# EAGLE design powernode (EAGLE 6.5.0)
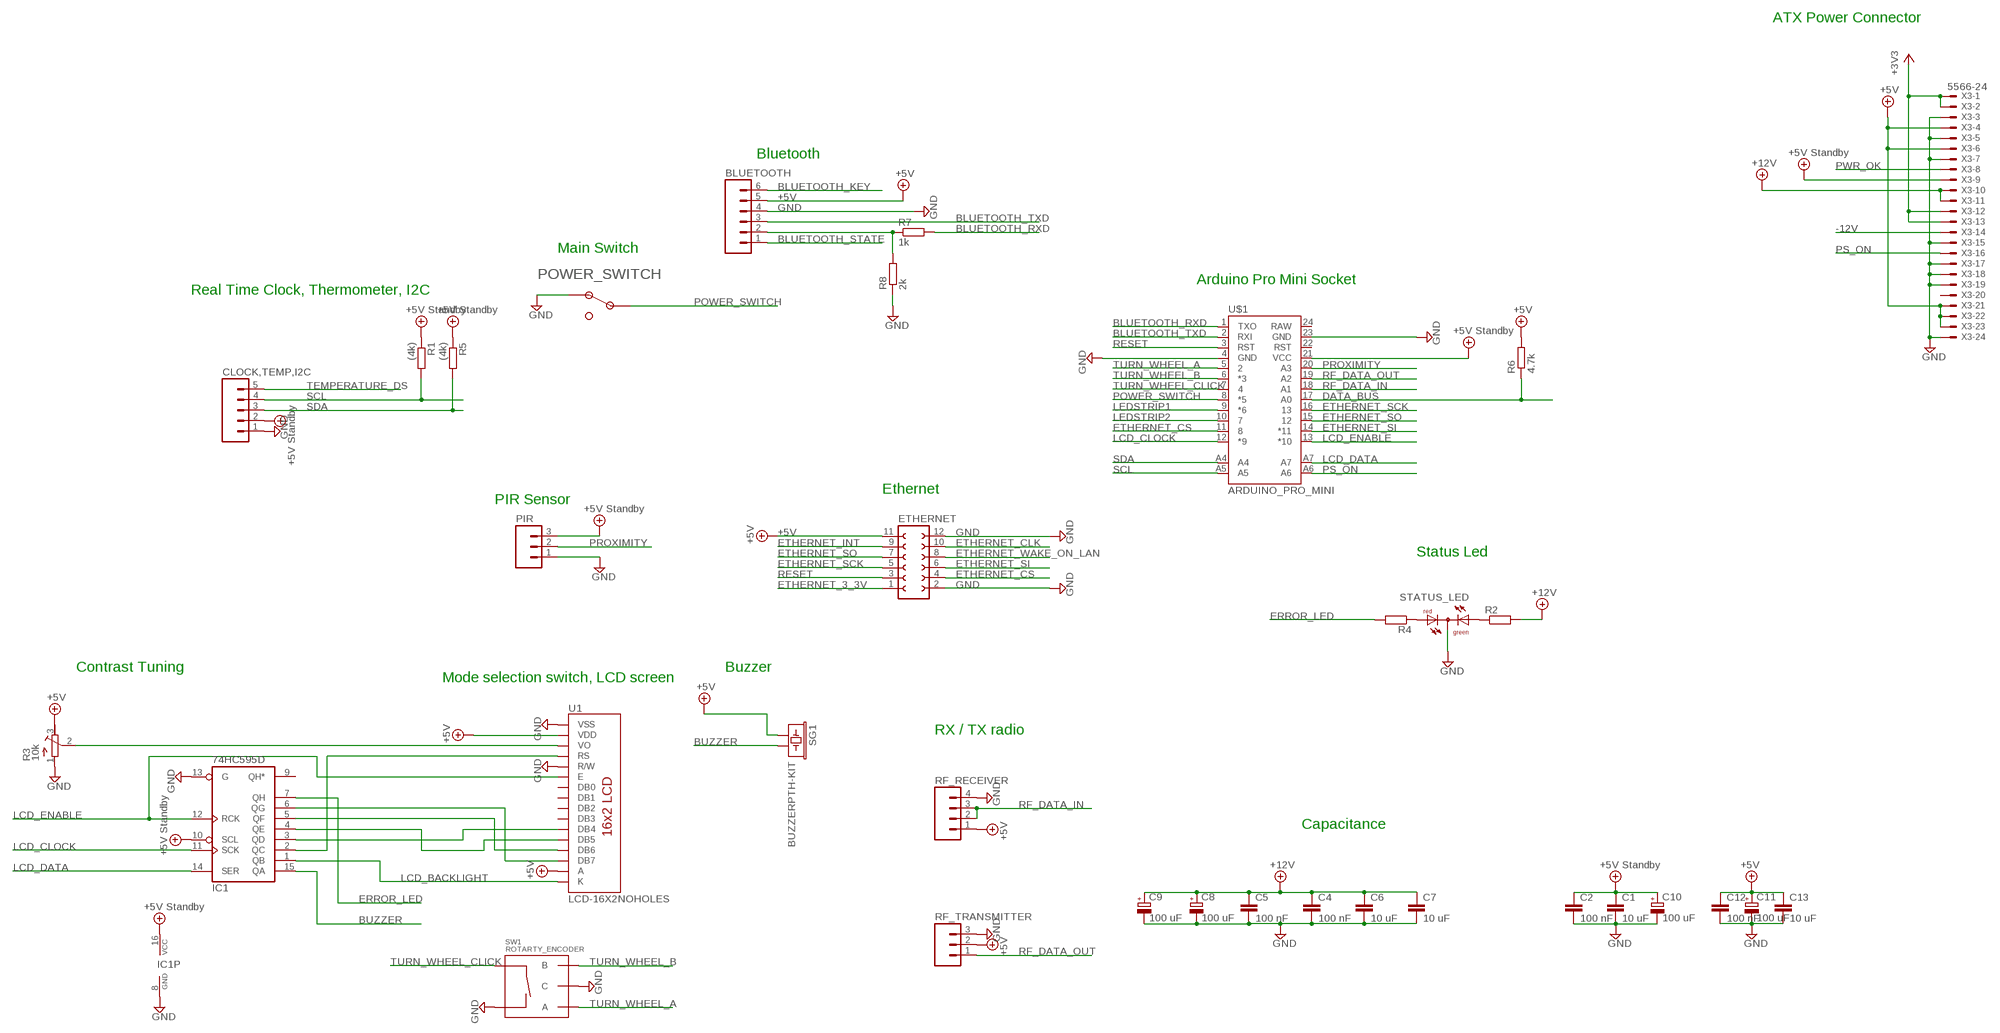
[diagram p0: schematic, sheet 1, part 1 of 2]
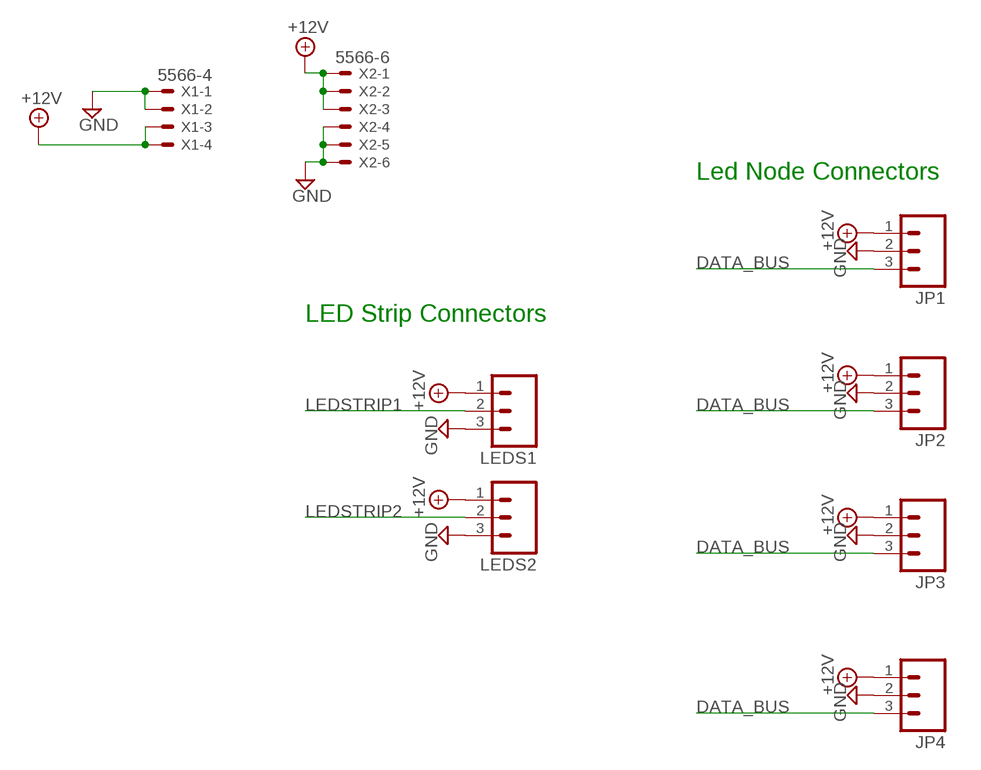
[diagram p1: schematic, sheet 1, part 2 of 2]

## Parts
BLUETOOTH  M06NO_SILK  [1X06_NO_SILK]
C1  10 uF  C-EUC1206  [C1206]
C2  100 nF  C-EUC0805  [C0805]
C4  100 nF  C-EUC0805  [C0805]
C5  100 nF  C-EUC0805  [C0805]
C6  10 uF  C-EUC1206  [C1206]
C7  10 uF  C-EUC1206  [C1206]
C8  100 uF  CPOL-EUE2.5-6  [E2,5-6]
C9  100 uF  CPOL-EUE2.5-6  [E2,5-6]
C10  100 uF  CPOL-EUE2.5-6  [E2,5-6]
C11  100 uF  CPOL-EUE2.5-6  [E2,5-6]
C12  100 nF  C-EUC0805  [C0805]
C13  10 uF  C-EUC1206  [C1206]
CLOCK,TEMP,I2C  M05PTH  [1X05]
ETHERNET  FE06-2  [FE06-2]
IC1  74HC595D  [SO16]
JP1  M03-SCREW-5MM  [SCREWTERMINAL-5MM-3]
JP2  M03-SCREW-5MM  [SCREWTERMINAL-5MM-3]
JP3  M03-SCREW-5MM  [SCREWTERMINAL-5MM-3]
JP4  M03-SCREW-5MM  [SCREWTERMINAL-5MM-3]
LEDS1  M03LONGPADS  [1X03_LONGPADS]
LEDS2  M03LONGPADS  [1X03_LONGPADS]
PIR  M031X03_NO_SILK  [1X03_NO_SILK]
POWER_SWITCH  KNC1-101-2P  [KNC1-101-2P]
R1  (4k)  R-EU_R0805  [R0805]
R2  R-EU_R0805  [R0805]
R3  10k  R-TRIMM3296W  [RTRIM3296W]
R4  R-EU_R0805  [R0805]
R5  (4k)  R-EU_R0805  [R0805]
R6  4.7k  R-EU_R0805  [R0805]
R7  1k  R-EU_R0805  [R0805]
R8  2k  R-EU_R0805  [R0805]
RF_RECEIVER  M041X04_NO_SILK  [1X04_NO_SILK]
RF_TRANSMITTER  M031X03_NO_SILK  [1X03_NO_SILK]
SG1  BUZZERPTH-KIT  [BUZZER-12MM-KIT]
STATUS_LED  DUOLED-RG-C  [DUOLED-C-5MM]
SW1  ROTARTY_ENCODER  [ROTARY_ENC_PLAIN]
U1  LCD-16X2NOHOLES  [LCD-16X2_NOHOLES]
U$1  ARDUINO_PRO_MINI  [ARDUINO_PRO_MINI]
X1  5566-4  [5566-4]
X2  5566-6  [5566-6]
X3  5566-24  [5566-24]

## Nets
+3V3: X3.1 X3.2 X3.12 X3.13
+5V: BLUETOOTH.5 C11.+ C12.1 C13.1 ETHERNET.11 R3.3(A) R6.2 RF_RECEIVER.1 RF_TRANSMITTER.2 SG1.+ U1.2(VDD) U1.15(A) X3.4 X3.6 X3.21 X3.22 X3.23
+5V/2: C1.1 C2.1 C10.+ CLOCK,TEMP,I2C.2 IC1.10(SCL) IC1.16(VCC) PIR.3 R1.1 R5.1 U$1.21(VCC) X3.9 ; supply symbol labelled +5V Standby
+12V: C4.1 C5.1 C6.1 C7.1 C8.+ C9.+ JP1.1 JP2.1 JP3.1 JP4.1 LEDS1.1 LEDS2.1 R2.2 X1.3 X1.4 X2.1 X2.2 X2.3 X3.10 X3.11
-12V: X3.14
BLUETOOTH_KEY: BLUETOOTH.6
BLUETOOTH_RXD: R7.2 U$1.1(TXO)
BLUETOOTH_STATE: BLUETOOTH.1
BLUETOOTH_TXD: BLUETOOTH.3 U$1.2(RXI)
BUZZER: IC1.15(QA) SG1.-
DATA_BUS: JP1.3 JP2.3 JP3.3 JP4.3 R6.1 U$1.17(A0)
ERROR_LED: IC1.7(QH) R4.2
ETHERNET_3_3V: ETHERNET.1
ETHERNET_CLK: ETHERNET.10
ETHERNET_CS: ETHERNET.4 U$1.11
ETHERNET_INT: ETHERNET.9
ETHERNET_SCK: ETHERNET.5 U$1.16
ETHERNET_SI: ETHERNET.6 U$1.14(*11)
ETHERNET_SO: ETHERNET.7 U$1.15
ETHERNET_WAKE_ON_LAN: ETHERNET.8
GND: BLUETOOTH.4 C1.2 C2.2 C4.2 C5.2 C6.2 C7.2 C8.- C9.- C10.- C11.- C12.2 C13.2 CLOCK,TEMP,I2C.1 ETHERNET.2 ETHERNET.12 IC1.8(GND) IC1.13(G) JP1.2 JP2.2 JP3.2 JP4.2 LEDS1.3 LEDS2.3 PIR.1 POWER_SWITCH.P$1 R3.1(E) R8.1 RF_RECEIVER.4 RF_TRANSMITTER.3 STATUS_LED.C SW1.C SW1.SW- U1.1(VSS) U1.5(R/W) U$1.4(GND) U$1.23(GND) X1.1 X1.2 X2.4 X2.5 X2.6 X3.3 X3.5 X3.7 X3.15 X3.17 X3.18 X3.19 X3.24
LCD_BACKLIGHT: IC1.1(QB) U1.16(K)
LCD_CLOCK: IC1.11(SCK) U$1.12(*9)
LCD_DATA: IC1.14(SER) U$1.A7
LCD_ENABLE: IC1.12(RCK) U1.6(E) U$1.13(*10)
LEDSTRIP1: LEDS1.2 U$1.9(*6)
LEDSTRIP2: LEDS2.2 U$1.10
N$1: IC1.3(QD) U1.11(DB4)
N$2: IC1.2(QC) U1.4(RS)
N$5: R2.1 STATUS_LED.AX(AG)
N$7: IC1.4(QE) U1.12(DB5)
N$8: IC1.5(QF) U1.13(DB6)
N$9: IC1.6(QG) U1.14(DB7)
N$10: U1.3(VO)
N$11: R4.1 STATUS_LED.AR
N$21: BLUETOOTH.2 R7.1 R8.2
POWER_SWITCH: POWER_SWITCH.P$2 U$1.8(*5)
PROXIMITY: PIR.2 U$1.20(A3)
PS_ON: U$1.A6 X3.16
PWR_OK: X3.8
RESET: ETHERNET.3 U$1.3(RST)
RF_DATA_IN: RF_RECEIVER.2 RF_RECEIVER.3 U$1.18(A1)
RF_DATA_OUT: RF_TRANSMITTER.1 U$1.19(A2)
SCL: CLOCK,TEMP,I2C.4 R1.2 U$1.A5
SDA: CLOCK,TEMP,I2C.3 R5.2 U$1.A4
TEMPERATURE_DS: CLOCK,TEMP,I2C.5
TURN_WHEEL_A: SW1.A U$1.5
TURN_WHEEL_B: SW1.B U$1.6(*3)
TURN_WHEEL_CLICK: SW1.SW+ U$1.7
Unconnected: IC1.9(QH*) R3.2(S) U1.7(DB0) U1.8(DB1) U1.9(DB2) U1.10(DB3) U$1.22(RST) U$1.24(RAW) X3.20

## Notes on the sheet
- ATX Power Connector
- Bluetooth | Led Node Connectors
- LED Strip Connectors
- Main Switch
- Arduino Pro Mini Socket
- Real Time Clock, Thermometer, I2C
- Ethernet
- PIR Sensor
- Status Led
- Contrast Tuning | Buzzer
- Mode selection switch, LCD screen
- RX / TX radio
- Capacitance

## Library data of the parts
BLUETOOTH = SparkFun-Connectors:M06: Header 6 Standard 6-pin 0.1" header. Use with straight break away headers (SKU : PRT-00116), right angle break away headers (PRT-00553), swiss pins (PRT-00743), machine pins (PRT-00117), and female headers (PRT-00115). Molex polarized connector foot print use with SKU : PRT-08094 with associated crimp pins and housings. NOTES ON THE VARIANTS LOCK and LOCK_LONGPADS... This footprint was designed to help hold the alignment of a through-hole component (i.e. 6-pin header) while soldering it into place. You may notice that each hole has been shifted either up or down by 0.005 of an inch from it's more standard position (which is a perfectly straight line). This slight alteration caused the pins (the squares in the middle) to touch the edges of the holes. Because they are alternating, it causes a "brace" to hold the component in place. 0.005 has proven to be the perfect amount of "off-center" position when using our standard breakaway headers. Although looks a little odd when you look at the bare footprint, once you have a header in there, the alteration is very hard to notice. Also,if you push a header all the way into place, it is covered up entirely on the bottom side. This idea of altering the position of holes to aid alignment will be further integrated into the Sparkfun Library for other footprints. It can help hold any component with 3 or more connection pins.
C1 C2 C4-C7 C12 C13 = rcl:C-EU: CAPACITOR, European symbol
C8-C11 = rcl:CPOL-EU: POLARIZED CAPACITOR, European symbol
CLOCK,TEMP,I2C = SparkFun:M05: Header 5 Standard 5-pin 0.1" header. Use with straight break away headers (SKU : PRT-00116), right angle break away headers (PRT-00553), swiss pins (PRT-00743), machine pins (PRT-00117), and female headers (PRT-00115). Molex polarized connector foot print use with SKU : PRT-08230 with associated crimp pins and housings.
ETHERNET = con-lsta:FE06-2: FEMALE HEADER; OC_FARNELL: unknown; OC_NEWARK: unknown
IC1 = 74xx-eu:74*595: 8-bit SHIFT REGISTER, output latch
JP1-JP4 = SparkFun-Connectors:M03: Header 3 Standard 3-pin 0.1" header. Use with straight break away headers (SKU : PRT-00116), right angle break away headers (PRT-00553), swiss pins (PRT-00743), machine pins (PRT-00117), and female headers (PRT-00115). Molex polarized connector foot print use with SKU : PRT-08232 with associated crimp pins and housings.; STOREFRONT_ID: PRT-08433
LEDS1 LEDS2 PIR RF_TRANSMITTER = SparkFun-Connectors:M03: Header 3 Standard 3-pin 0.1" header. Use with straight break away headers (SKU : PRT-00116), right angle break away headers (PRT-00553), swiss pins (PRT-00743), machine pins (PRT-00117), and female headers (PRT-00115). Molex polarized connector foot print use with SKU : PRT-08232 with associated crimp pins and housings.
POWER_SWITCH = knc1-101-switch:KNC1-101-2P
R1 R2 R4-R8 = rcl:R-EU_: RESISTOR, European symbol
R3 = resistor:R-TRIMM: Trimm resistor
RF_RECEIVER = SparkFun-Connectors:M04: Header 4 Standard 4-pin 0.1" header. Use with straight break away headers (SKU : PRT-00116), right angle break away headers (PRT-00553), swiss pins (PRT-00743), machine pins (PRT-00117), and female headers (PRT-00115). Molex polarized connector foot print use with SKU : PRT-08231 with associated crimp pins and housings. 1MM SMD Version SKU: PRT-10208
SG1 = SparkFun-Electromechanical:BUZZER: Buzzer 12mm Spark Fun Electronics SKU : Comp-Buzzer; PROD_ID: COMP-08253
STATUS_LED = led:DUOLED-RG-C: DUO LED 2 colors (red/green), 5 mm, round, common Cathode www.ligitek.com or other producers.
SW1 = SparkFun-Electromechanical:ROTARTY_ENCODER: Simple no LED rotary encoder Example: COM-09117
U1 = SparkFun:LCD-16X2
U$1 = SparkFun-Boards-with-arduino-pro-mini-without-connection-pins:ARDUINO_PRO_MINI
X1 = con-molex--with-atx-connectors-without-side-screws:5566-4: Mini FIT connector 4 pol Source: http://www.molex.com; OC_FARNELL: unknown; OC_NEWARK: unknown
X2 = con-molex--with-atx-connectors-without-side-screws:5566-6: Mini FIT connector 6 pol Source: http://www.molex.com; MPN: 95566-61002; OC_FARNELL: unknown; OC_NEWARK: 22K8620
X3 = con-molex--with-atx-connectors-without-side-screws:5566-24: Mini FIT connector 24 pol Source: http://www.molex.com; OC_FARNELL: unknown; OC_NEWARK: unknown

## Board
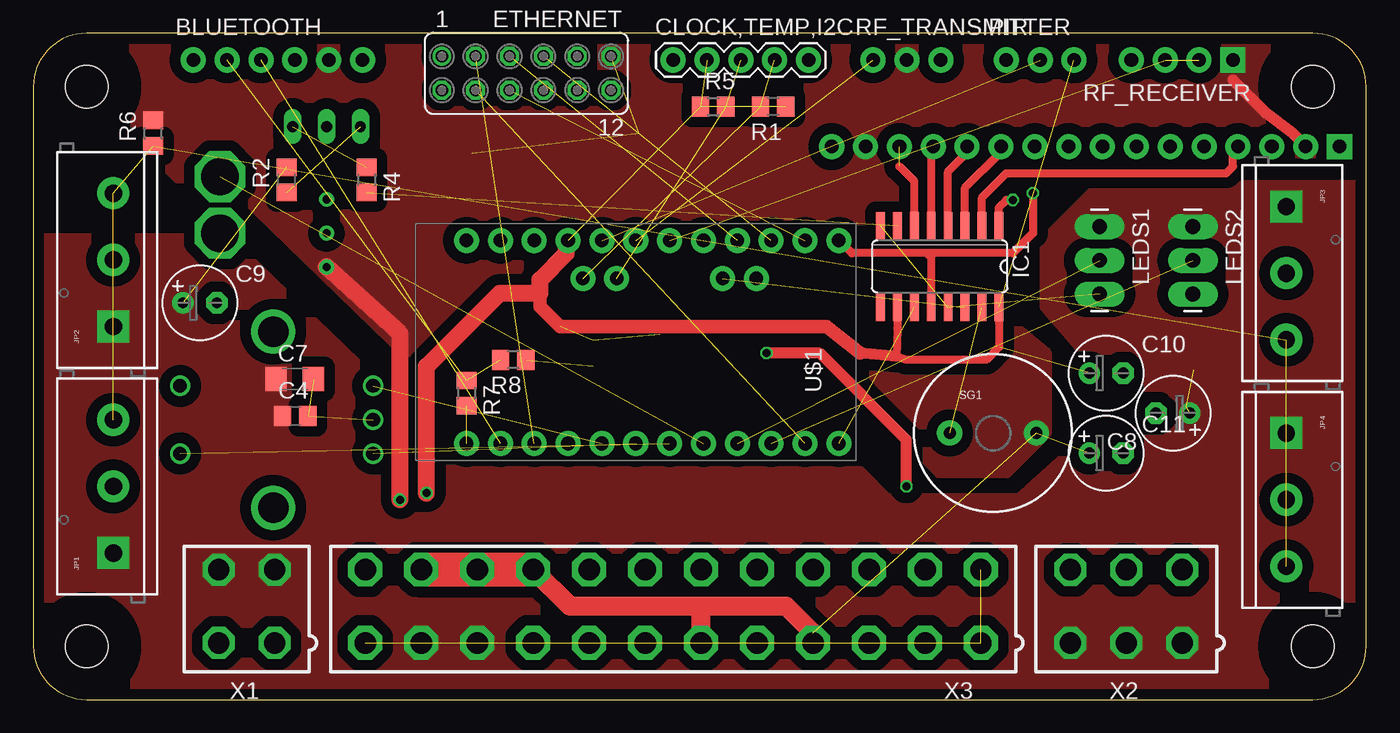
[diagram p2: board, top side]
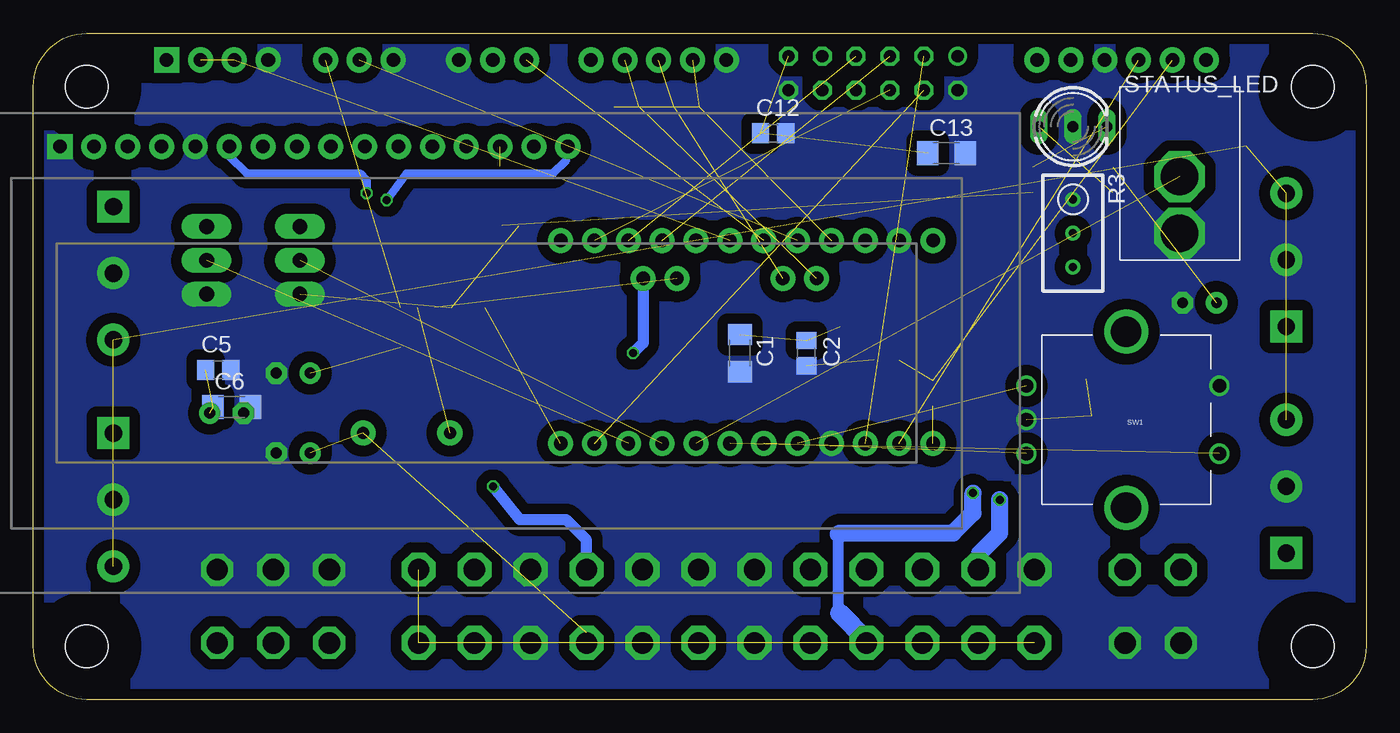
[diagram p3: board, bottom side, seen from below]

Size 100 x 50 mm. Coordinates in mm from the lower left corner, seen from the top.
Outline: 0,46 0,4 arc90 4,0 96,0 arc90 100,4 100,46 arc90 96,50 4,50 arc90 0,46
Copper layers (1*16): Top 0.035mm / dielectric 1.5mm / Bottom 0.035mm
Design rules "SeeedStudio_2layer_DRU_no_angle_20140221": minimum track width 6mil, minimum drill 12mil, track to track 6mil, track to pad 6mil, pad to pad 6mil, via to via 6mil, smd to smd 0mil, copper to edge 10mil, drill to drill 10mil, minimum pad ring 10mil, minimum via ring 6mil, stop-mask expansion 2mil, vias tented up to drill 100mil, thermal gap 10mil
Holes 3.2 mm at 4,4 4,46 96,46 96,4
tRestrict: area 94,44 to 98,48; area 94,2 to 98,6; area 2,2 to 6,6; area 2,44 to 6,48
bRestrict: area 2,2 to 6,6; area 2,44 to 6,48; area 94,2 to 98,6; area 94,44 to 98,48

### Footprints (pad centres in the part's own frame; a part is rotated, then mirrored left to right if it is on the bottom)
1X06_NO_SILK = drill 1.016 pad 1.88: 1 0,0; 2 2.54,0; 3 5.08,0; 4 7.62,0; 5 10.16,0; 6 12.7,0
C1206 = smd 1.6 x 1.8: 1 -1.4,0; 2 1.4,0
C0805 = smd 1.3 x 1.5: 1 -0.95,0; 2 0.95,0
E2,5-6 = drill 0.813 pad 1.6: + -1.27,0 | drill 0.813 pad 1.6 octagon: - 1.27,0
1X05 = drill 1.016 pad 1.88: 1 0,0; 2 2.54,0; 3 5.08,0; 4 7.62,0; 5 10.16,0
FE06-2 = drill 0.914: 1 -6.35,1.27 | drill 0.914 octagon: 2 -6.35,-1.27; 3 -3.81,1.27; 4 -3.81,-1.27; 5 -1.27,1.27; 6 -1.27,-1.27; 7 1.27,1.27; 8 1.27,-1.27; 9 3.81,1.27; 10 3.81,-1.27; 11 6.35,1.27; 12 6.35,-1.27
SO16 = smd 0.66 x 2.032: 1 -4.445,-3.073; 2 -3.175,-3.073; 3 -1.905,-3.073; 4 -0.635,-3.073; 5 0.635,-3.073; 6 1.905,-3.073; 7 3.175,-3.073; 8 4.445,-3.073; 9 4.445,3.073; 10 3.175,3.073; 11 1.905,3.073; 12 0.635,3.073; 13 -0.635,3.073; 14 -1.905,3.073; 15 -3.175,3.073; 16 -4.445,3.073
SCREWTERMINAL-5MM-3 = drill 1.3 pad 2.413 square: 1 0,0 | drill 1.3 pad 2.413: 2 5,0; 3 10,0
1X03_LONGPADS = drill 1.118 pad 1.88 long: 1 0,0; 2 2.54,0; 3 5.08,0
1X03_NO_SILK = drill 1.016 pad 1.88: 1 0,0; 2 2.54,0; 3 5.08,0
KNC1-101-2P = drill 2.8 pad 3.81 octagon: P$1 0,-2; P$2 0,2.25
R0805 = smd 1.3 x 1.5: 1 -0.95,0; 2 0.95,0
RTRIM3296W = drill 0.61: 1 0,-2.54; 2 0,0; 3 0,2.54
1X04_NO_SILK = drill 1.016 pad 1.88 square: 1 0,0 | drill 1.016 pad 1.88: 2 2.54,0; 3 5.08,0; 4 7.62,0
BUZZER-12MM-KIT = drill 0.9 pad 1.88: + 3.25,0; - -3.25,0
DUOLED-C-5MM = drill 0.813 long: AR 2.54,0; AX -2.54,0; C 0,0
ROTARY_ENC_PLAIN = drill 1.016: A 7.493,-2.54; B 7.493,2.54; C 7.493,0; SW+ -6.985,2.54; SW- -6.985,-2.54 | drill 2.286: P$3 0,6.604; P$4 0,-6.604
LCD-16X2_NOHOLES = drill 1.016 pad 1.88 square: 1 -32,15.5 | drill 1.016 pad 1.88: 2 -29.46,15.5; 3 -26.92,15.5; 4 -24.38,15.5; 5 -21.84,15.5; 6 -19.3,15.5; 7 -16.76,15.5; 8 -14.22,15.5; 9 -11.68,15.5; 10 -9.14,15.5; 11 -6.6,15.5; 12 -4.06,15.5; 13 -1.52,15.5; 14 1.02,15.5; 15 3.56,15.5; 16 6.1,15.5
ARDUINO_PRO_MINI = drill 1.016 pad 1.88: 1 -7.62,12.7; 2 -7.62,10.16; 3 -7.62,7.62; 4 -7.62,5.08; 5 -7.62,2.54; 6 -7.62,0; 7 -7.62,-2.54; 8 -7.62,-5.08; 9 -7.62,-7.62; 10 -7.62,-10.16; 11 -7.62,-12.7; 12 -7.62,-15.24; 13 7.62,-15.24; 14 7.62,-12.7; 15 7.62,-10.16; 16 7.62,-7.62; 17 7.62,-5.08; 18 7.62,-2.54; 19 7.62,0; 20 7.62,2.54; 21 7.62,5.08; 22 7.62,7.62; 23 7.62,10.16; 24 7.62,12.7; A4 4.763,1.429; A5 4.763,3.969; A6 4.763,-9.049; A7 4.763,-6.509
5566-4 = drill 1.6 octagon: 1 2.1,-2.75; 2 -2.1,-2.75; 3 2.1,2.75; 4 -2.1,2.75
5566-6 = drill 1.6 octagon: 1 4.2,-2.75; 2 0,-2.75; 3 -4.2,-2.75; 4 4.2,2.75; 5 0,2.75; 6 -4.2,2.75
5566-24 = drill 1.6 pad 2.54 octagon: 1 23.1,-2.75; 2 18.9,-2.75; 3 14.7,-2.75; 4 10.5,-2.75; 5 6.3,-2.75; 6 2.1,-2.75; 7 -2.1,-2.75; 8 -6.3,-2.75; 9 -10.5,-2.75; 10 -14.7,-2.75; 11 -18.9,-2.75; 12 -23.1,-2.75; 13 23.1,2.75; 14 18.9,2.75; 15 14.7,2.75; 16 10.5,2.75; 17 6.3,2.75; 18 2.1,2.75; 19 -2.1,2.75; 20 -6.3,2.75; 21 -10.5,2.75; 22 -14.7,2.75; 23 -18.9,2.75; 24 -23.1,2.75

### Placement (x,y rotation side)
BLUETOOTH  12,48 0 top
C1  47,26 270 bottom
C2  42,26 270 bottom
C4  19.66,21.28 0 top
C5  86.12,24.74 0 bottom
C6  85.12,21.96 0 bottom
C7  19.62,24.06 0 top
C8  85.5,21.5 180 top
C9  12.5,29.78 0 top
C10  80.5,24.5 0 top
C11  80.5,18.5 0 top
C12  44.5,42.5 0 bottom
C13  31.5,41 0 bottom
CLOCK,TEMP,I2C  48,48 0 top
ETHERNET  37,47 0 top
IC1  68,32.5 180 top
JP1  6,11 90 top
JP2  6,28 90 top
JP3  94,37 270 top
JP4  94,20 270 top
LEDS1  80,35.5 270 top
LEDS2  87,35.5 270 top
PIR  73,48 0 top
POWER_SWITCH  14,37 0 bottom
R1  55.5,44.5 180 top
R2  19,39 90 top
R3  22,35 180 bottom
R4  25,39 270 top
R5  51,44.5 0 top
R6  9,42.5 90 top
R7  32.5,23 270 top
R8  36,25.5 180 top
RF_RECEIVER  90,48 180 top
RF_TRANSMITTER  63,48 0 top
SG1  72,20 0 top
STATUS_LED  22,43 0 bottom
SW1  18,21 180 bottom
U1  66,26 0 bottom
U$1  45.2,26.84 90 top
X1  16,7 0 top
X2  82,7 0 top
X3  48,7 0 top

### Tracks (layer width: path | path; a pad name or v marks a point on that pad's centre or on a via)
+3V3  (3 unrouted)
+5V  (via drill 0.6)  (4 unrouted)
  Top 0.813: U1.2 95.46,41.54 94.5,42.5 92.5,44 90,46.5
  Top 1.27: v27.5,15 27.5,27.46 R3.3
  Top 1.422: X3.4 58.5,5 56.5,7 50,7 | 50,7 40.25,7 X3.21 | X3.6 50.1,6.9 50,7
  Top 2.54: X3.21 X3.22 X3.23
  Bottom 1.27: X3.23 29,11 27.5,12.5 v27.5,15
  pour Top (isolate 0.813, no thermals): 0,50 100,50 100,41 78,41 73,35 73,28.5 76,26 76,20 73,17 68,17 66,19 35,19 32,22 15.5,38 12,38
+5V/2  (via drill 0.6)  (7 unrouted)
  Top 0.61: IC1.10 64.83,27.82 64.75,25.75 65.5,25.5 71.5,25.5 72.44,26.45 IC1.16
  Top 0.813: 64.75,25.75 62,26
  Top 1.016: 38,30.5 38,29.5 39.5,28 59.5,28 62,26
  Top 1.27: v29.5,15.5 29.5,25 35,30.5 38,30.5 38,31.5 40,33.5 40,34.34 U$1.21
  Bottom 0.813: 39.5,6.5 39.6,6.6 39.6,12.4
  Bottom 1.27: 39.6,12.4 39.5,12.5 31,12.5 29.5,14 v29.5,15.5
  Bottom 1.422: X3.9 37.5,4.5 39.5,6.5
+12V  (3 unrouted)
  pour Top (isolate 0.813, no thermals): 0,34.5 14.5,34.5 28.5,21 32.5,17 62,17 64,15 74,15 79,19.5 79,26 76,29.5 76,34.5 80,38.5 100,38.5 100,0 0,0
BLUETOOTH_RXD  (1 unrouted)
BLUETOOTH_TXD  (1 unrouted)
BUZZER  (1 unrouted)
DATA_BUS  (5 unrouted)
ERROR_LED  (1 unrouted)
ETHERNET_CS  (1 unrouted)
ETHERNET_SCK  (1 unrouted)
ETHERNET_SI  (1 unrouted)
ETHERNET_SO  (1 unrouted)
GND  (5 unrouted)
  pour Bottom (isolate 0.813, no thermals): 0,0 100,0 100,50 0,50
LCD_BACKLIGHT  (via drill 0.6)
  Top 0.61: IC1.1 72.44,36.95 73,37.5 v73.5,37.5
  Bottom 0.61: v73.5,37.5 72,39.5 61,39.5 60,40.5 60,41.4 U1.16
LCD_CLOCK  (1 unrouted)
LCD_DATA  (1 unrouted)
LCD_ENABLE  (via drill 0.6)
  Top 0.61: v75,38 75,35 73.5,33.5 67.5,33.5 | 67.14,33.37 67.5,33.5 | 67.5,33.5 61.4,33.5 U$1.13 | IC1.12 67.36,33.37 67.5,33.5
  Bottom 0.61: U1.6 85.3,40.8 84,39.5 75.5,39.5 75,39 v75,38
LEDSTRIP1  (1 unrouted)
LEDSTRIP2  (1 unrouted)
N$1
  Top 0.61: IC1.3 69.91,38.41 72.5,41 72.5,41.4 U1.11
N$2
  Top 0.61: IC1.2 71.17,37.67 73,39.5 89.5,39.5 90,40 90,41.12 U1.4
N$5  (1 unrouted)
N$7
  Top 0.61: IC1.4 68.64,39.63 70,41 70,41.44 U1.12
N$8
  Top 0.61: IC1.5 67.36,41.13 67.5,41.5 67.5,41.48 U1.13
N$9  (1 unrouted)
  Top 0.61: 64.98,40.02 66.09,38.91 IC1.6
N$11  (1 unrouted)
N$21  (2 unrouted)
POWER_SWITCH  (1 unrouted)
PROXIMITY  (1 unrouted)
PS_ON  (via drill 0.6)
  Top 0.813: v65.5,16 65.5,19.5 59,26 v55,26
  Top 1.27: X3.16 v58.5,9.5
  Bottom 0.813: v58.5,9.5 58.5,12 60,13.5 63.5,13.5 v65.5,16 | v55,26 54.25,26.75 U$1.A6
RESET  (1 unrouted)
RF_DATA_IN  (2 unrouted)
RF_DATA_OUT  (1 unrouted)
SCL  (2 unrouted)
SDA  (2 unrouted)
TURN_WHEEL_A  (1 unrouted)
TURN_WHEEL_B  (1 unrouted)
TURN_WHEEL_CLICK  (1 unrouted)